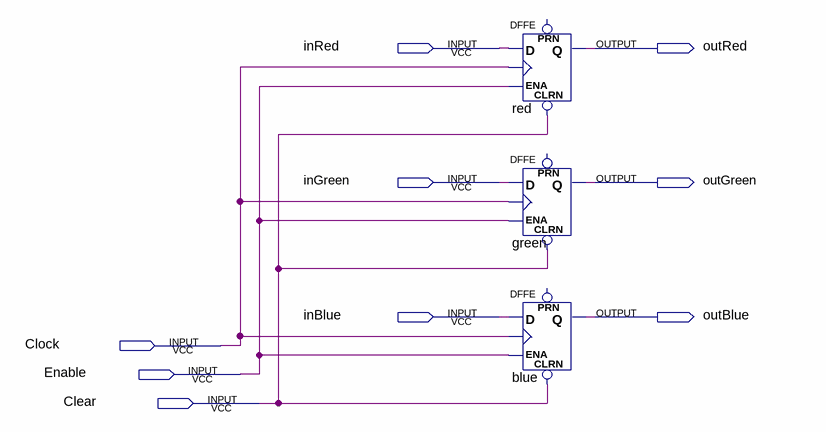
[diagram p0: schematic sheet]
// Quartus schematic colorCellUnit.bdf as structural Verilog: 3 symbols, 9 pins
module colorCellUnit (
  input  inRed,
  input  inGreen,
  input  inBlue,
  input  Clock,
  input  Enable,
  input  Clear,
  output outRed,
  output outGreen,
  output outBlue
);

  DFFE red (.CLRN(Clear), .D(inRed), .CLK(Clock), .ENA(Enable), .Q(outRed));  // open: PRN
  DFFE green (.CLRN(Clear), .D(inGreen), .CLK(Clock), .ENA(Enable), .Q(outGreen));  // open: PRN
  DFFE blue (.CLRN(Clear), .D(inBlue), .CLK(Clock), .ENA(Enable), .Q(outBlue));  // open: PRN
endmodule
